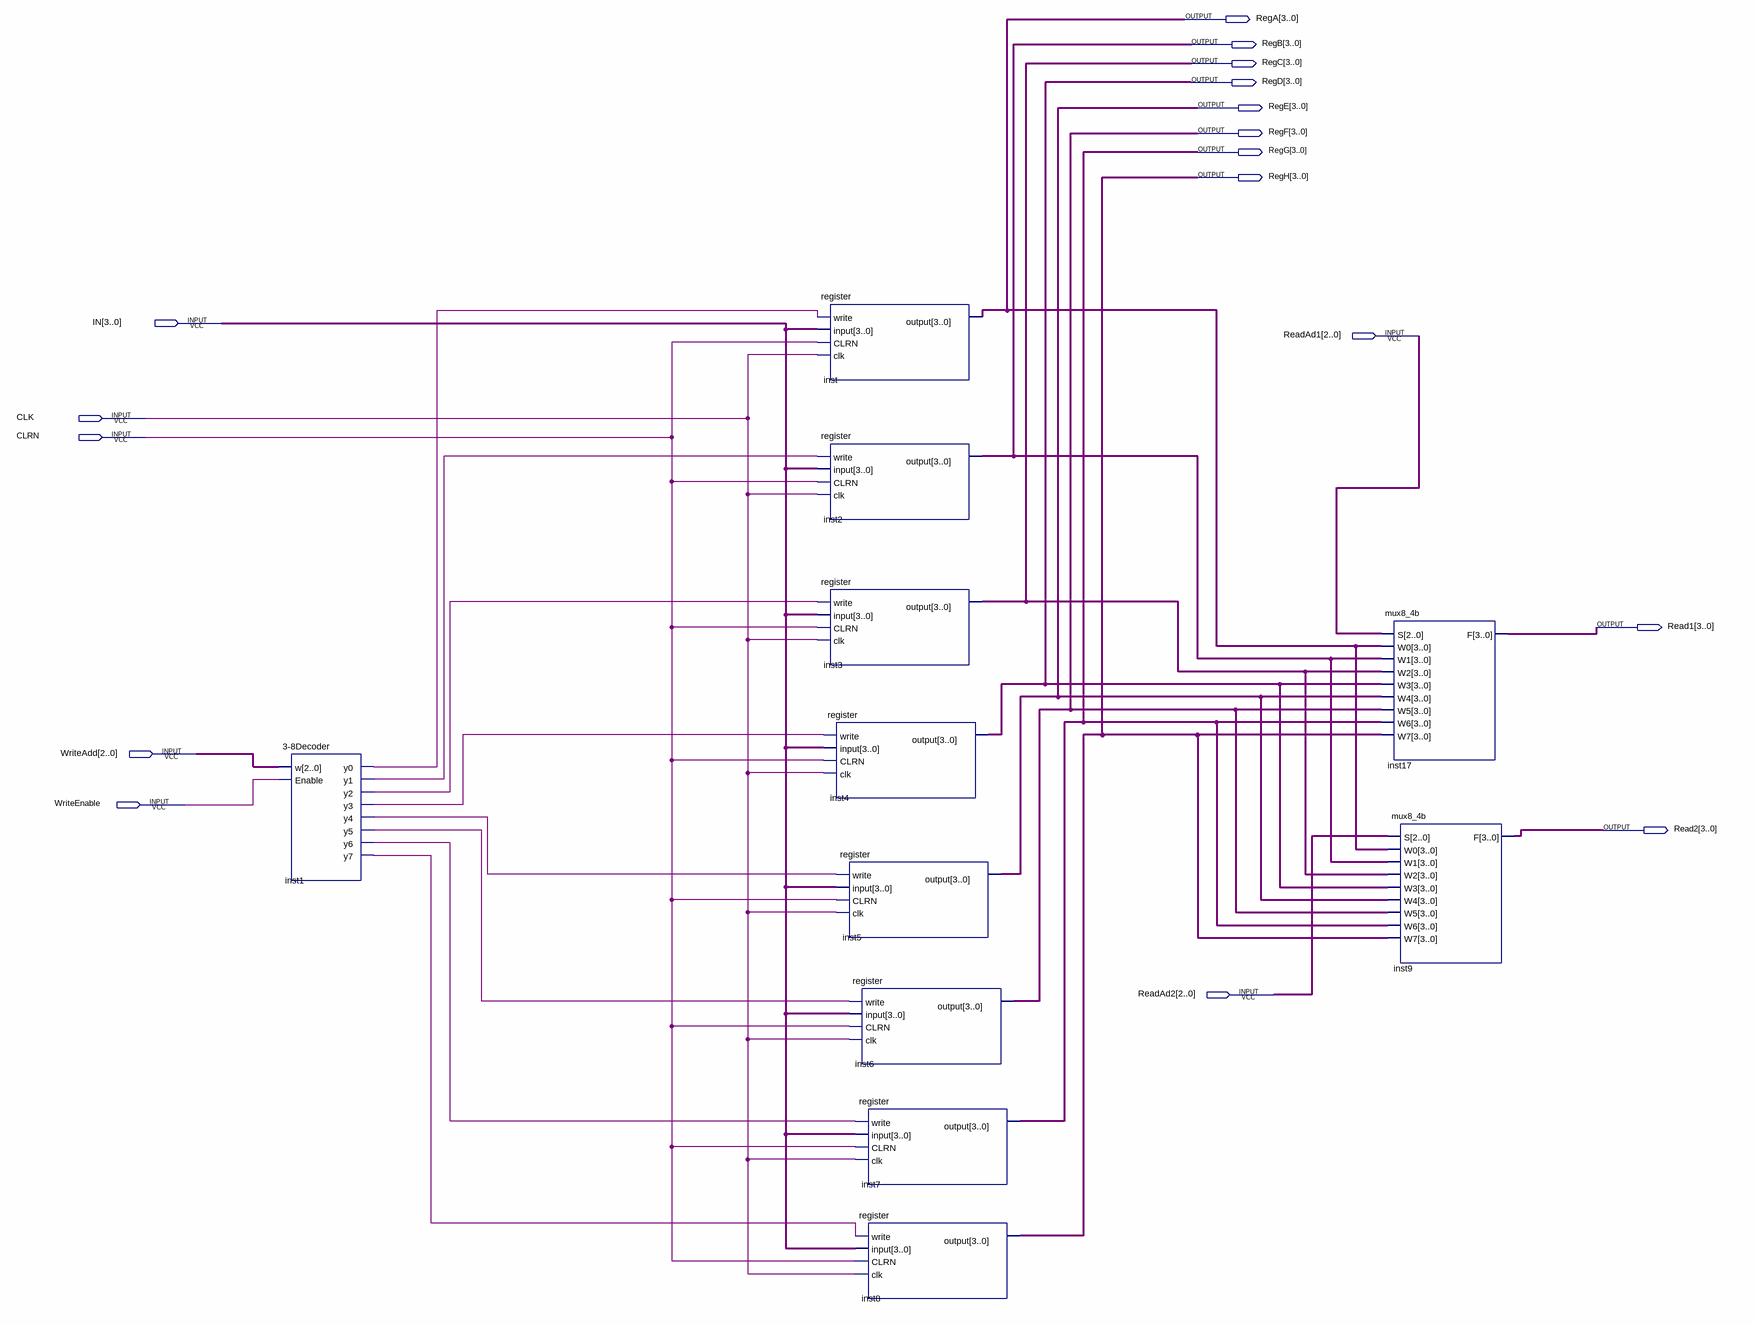
[diagram p0: schematic sheet]
// Quartus schematic registerfile.bdf as structural Verilog: 11 symbols, 17 pins
module registerfile (
  input  [3:0] IN,
  input  [2:0] ReadAd1,
  input  CLK,
  input  CLRN,
  input  [2:0] WriteAdd,
  input  WriteEnable,
  input  [2:0] ReadAd2,
  output [3:0] RegA,
  output [3:0] RegB,
  output [3:0] RegC,
  output [3:0] RegD,
  output [3:0] RegE,
  output [3:0] RegF,
  output [3:0] RegG,
  output [3:0] RegH,
  output [3:0] Read1,
  output [3:0] Read2
);

  wire inst1_y0, inst1_y1, inst1_y2, inst1_y3, inst1_y4, inst1_y5, inst1_y6, inst1_y7;

  \3-8Decoder  inst1 (
    .w(WriteAdd), .Enable(WriteEnable), .y0(inst1_y0), .y1(inst1_y1), .y2(inst1_y2), .y3(inst1_y3),
    .y4(inst1_y4), .y5(inst1_y5), .y6(inst1_y6), .y7(inst1_y7));
  register inst (.write(inst1_y0), .\input (IN), .CLRN(CLRN), .clk(CLK), .\output (RegA));
  register inst2 (.write(inst1_y1), .\input (IN), .CLRN(CLRN), .clk(CLK), .\output (RegB));
  register inst3 (.write(inst1_y2), .\input (IN), .CLRN(CLRN), .clk(CLK), .\output (RegC));
  register inst4 (.write(inst1_y3), .\input (IN), .CLRN(CLRN), .clk(CLK), .\output (RegD));
  register inst5 (.write(inst1_y4), .\input (IN), .CLRN(CLRN), .clk(CLK), .\output (RegE));
  register inst6 (.write(inst1_y5), .\input (IN), .CLRN(CLRN), .clk(CLK), .\output (RegF));
  register inst7 (.write(inst1_y6), .\input (IN), .CLRN(CLRN), .clk(CLK), .\output (RegG));
  register inst8 (.write(inst1_y7), .\input (IN), .CLRN(CLRN), .clk(CLK), .\output (RegH));
  mux8_4b inst17 (
    .S(ReadAd1), .W0(RegA), .W1(RegB), .W2(RegC), .W3(RegD), .W4(RegE), .W5(RegF), .W6(RegG), .W7(RegH),
    .F(Read1));
  mux8_4b inst9 (
    .S(ReadAd2), .W0(RegA), .W1(RegB), .W2(RegC), .W3(RegD), .W4(RegE), .W5(RegF), .W6(RegG), .W7(RegH),
    .F(Read2));
endmodule
